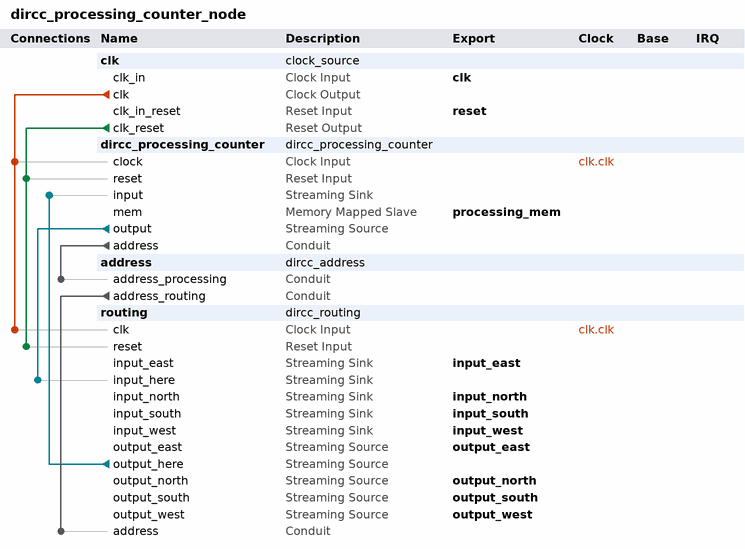
[diagram p0: system contents]
# Platform Designer (Qsys) system dircc_processing_counter_node, Cyclone V 5CSEMA5F31C6
# Parameters at their usual value, and those the tool derives, are not listed.
package require -exact qsys 16.1
create_system dircc_processing_counter_node
set_project_property DEVICE_FAMILY {Cyclone V}
set_project_property DEVICE 5CSEMA5F31C6

add_instance clk clock_source 16.1
set_instance_parameter_value clk clockFrequency 50000000

add_instance dircc_processing_counter dircc_processing_counter 1.0
set_instance_parameter_value dircc_processing_counter ADDRESS_MEM_WIDTH 32
set_instance_parameter_value dircc_processing_counter BITS_PER_SYMBOL 8
set_instance_parameter_value dircc_processing_counter DEVICE_ID 0
set_instance_parameter_value dircc_processing_counter DIRCC_RTS_FLAGS_COMPUTE 2147483648
set_instance_parameter_value dircc_processing_counter INPUT_FIFO_DEPTH 8
set_instance_parameter_value dircc_processing_counter RTS_READY_WIDTH 32
set_instance_parameter_value dircc_processing_counter STATUS_ADDRESS_WIDTH 15
set_instance_parameter_value dircc_processing_counter STATUS_BYTE_WIDTH 8
set_instance_parameter_value dircc_processing_counter STATUS_DEV_MEM_WIDTH 12
set_instance_parameter_value dircc_processing_counter STATUS_EDGE_MEM_WIDTH 12
set_instance_parameter_value dircc_processing_counter STATUS_MEM_WIDTH 16
set_instance_parameter_value dircc_processing_counter SYMBOLS_PER_BEAT 4

add_instance address dircc_address 1.0
set_instance_parameter_value address ADDRESS 0

add_instance routing dircc_routing 1.0

# connections
add_connection clk.clk dircc_processing_counter.clock clock
add_connection clk.clk routing.clk clock
add_connection clk.clk_reset dircc_processing_counter.reset reset
add_connection clk.clk_reset routing.reset reset
add_connection dircc_processing_counter.output routing.input_here avalon_streaming
add_connection routing.output_here dircc_processing_counter.input avalon_streaming
add_connection address.address_routing routing.address conduit
add_connection dircc_processing_counter.address address.address_processing conduit

# exported interfaces
add_interface clk clock sink
set_interface_property clk EXPORT_OF clk.clk_in
add_interface input_east avalon_streaming sink
set_interface_property input_east EXPORT_OF routing.input_east
add_interface input_north avalon_streaming sink
set_interface_property input_north EXPORT_OF routing.input_north
add_interface input_south avalon_streaming sink
set_interface_property input_south EXPORT_OF routing.input_south
add_interface input_west avalon_streaming sink
set_interface_property input_west EXPORT_OF routing.input_west
add_interface output_east avalon_streaming source
set_interface_property output_east EXPORT_OF routing.output_east
add_interface output_north avalon_streaming source
set_interface_property output_north EXPORT_OF routing.output_north
add_interface output_south avalon_streaming source
set_interface_property output_south EXPORT_OF routing.output_south
add_interface output_west avalon_streaming source
set_interface_property output_west EXPORT_OF routing.output_west
add_interface processing_mem avalon slave
set_interface_property processing_mem EXPORT_OF dircc_processing_counter.mem
add_interface reset reset sink
set_interface_property reset EXPORT_OF clk.clk_in_reset

set_interconnect_requirement {$system} qsys_mm.clockCrossingAdapter HANDSHAKE
set_interconnect_requirement {$system} qsys_mm.enableEccProtection FALSE
set_interconnect_requirement {$system} qsys_mm.insertDefaultSlave FALSE
set_interconnect_requirement {$system} qsys_mm.maxAdditionalLatency 1

save_system dircc_processing_counter_node.qsys
